# Altium schematic sheet LED.SchDoc
size A4
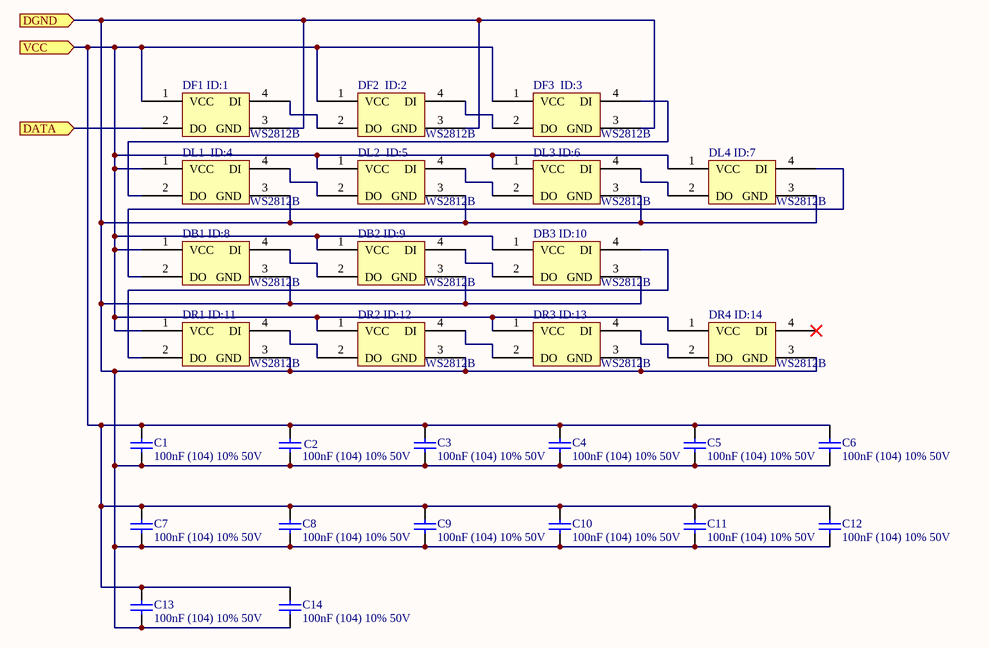
[diagram p0: LED.SchDoc]

## Parts
C1  100nF (104) 10% 50V  [0603_C]
C2  100nF (104) 10% 50V  [0603_C]
C3  100nF (104) 10% 50V  [0603_C]
C4  100nF (104) 10% 50V  [0603_C]
C5  100nF (104) 10% 50V  [0603_C]
C6  100nF (104) 10% 50V  [0603_C]
C7  100nF (104) 10% 50V  [0603_C]
C8  100nF (104) 10% 50V  [0603_C]
C9  100nF (104) 10% 50V  [0603_C]
C10  100nF (104) 10% 50V  [0603_C]
C11  100nF (104) 10% 50V  [0603_C]
C12  100nF (104) 10% 50V  [0603_C]
C13  100nF (104) 10% 50V  [0603_C]
C14  100nF (104) 10% 50V  [0603_C]
DB1_ID:8  WS2812B  [LED5050_4]
DB2_ID:9  WS2812B  [LED5050_4]
DB3_ID:10  WS2812B  [LED5050_4]
DF1_ID:1  WS2812B  [LED5050_4]
DF2_ID:2  WS2812B  [LED5050_4]
DF3_ID:3  WS2812B  [LED5050_4]
DL1_ID:4  WS2812B  [LED5050_4]
DL2_ID:5  WS2812B  [LED5050_4]
DL3_ID:6  WS2812B  [LED5050_4]
DL4_ID:7  WS2812B  [LED5050_4]
DR1_ID:11  WS2812B  [LED5050_4]
DR2_ID:12  WS2812B  [LED5050_4]
DR3_ID:13  WS2812B  [LED5050_4]
DR4_ID:14  WS2812B  [LED5050_4]

## Ports
DATA (in), DGND (in), VCC (in)

## Nets
DATA: DF1_ID:1.2(DO) ; port DATA
DGND: C1.1 C2.1 C3.1 C4.1 C5.1 C6.1 C7.1 C8.1 C9.1 C10.1 C11.1 C12.1 C13.1 C14.1 DB1_ID:8.3(GND) DB2_ID:9.3(GND) DB3_ID:10.3(GND) DF1_ID:1.3(GND) DF2_ID:2.3(GND) DF3_ID:3.3(GND) DL1_ID:4.3(GND) DL2_ID:5.3(GND) DL3_ID:6.3(GND) DL4_ID:7.3(GND) DR1_ID:11.3(GND) DR2_ID:12.3(GND) DR3_ID:13.3(GND) DR4_ID:14.3(GND) ; port DGND
VCC: C1.2 C2.2 C3.2 C4.2 C5.2 C6.2 C7.2 C8.2 C9.2 C10.2 C11.2 C12.2 C13.2 C14.2 DB1_ID:8.1(VCC) DB2_ID:9.1(VCC) DB3_ID:10.1(VCC) DF1_ID:1.1(VCC) DF2_ID:2.1(VCC) DF3_ID:3.1(VCC) DL1_ID:4.1(VCC) DL2_ID:5.1(VCC) DL3_ID:6.1(VCC) DL4_ID:7.1(VCC) DR1_ID:11.1(VCC) DR2_ID:12.1(VCC) DR3_ID:13.1(VCC) DR4_ID:14.1(VCC) ; port VCC
NetDB1_ID:8_2: DB1_ID:8.2(DO) DL4_ID:7.4(DI)
NetDB1_ID:8_4: DB1_ID:8.4(DI) DB2_ID:9.2(DO)
NetDB2_ID:9_4: DB2_ID:9.4(DI) DB3_ID:10.2(DO)
NetDB3_ID:10_4: DB3_ID:10.4(DI) DR1_ID:11.2(DO)
NetDF1_ID:1_4: DF1_ID:1.4(DI) DF2_ID:2.2(DO)
NetDF2_ID:2_4: DF2_ID:2.4(DI) DF3_ID:3.2(DO)
NetDF3_ID:3_4: DF3_ID:3.4(DI) DL1_ID:4.2(DO)
NetDL1_ID:4_4: DL1_ID:4.4(DI) DL2_ID:5.2(DO)
NetDL2_ID:5_4: DL2_ID:5.4(DI) DL3_ID:6.2(DO)
NetDL3_ID:6_4: DL3_ID:6.4(DI) DL4_ID:7.2(DO)
NetDR1_ID:11_4: DR1_ID:11.4(DI) DR2_ID:12.2(DO)
NetDR2_ID:12_4: DR2_ID:12.4(DI) DR3_ID:13.2(DO)
NetDR3_ID:13_4: DR3_ID:13.4(DI) DR4_ID:14.2(DO)

Not connected (* = marked no-connect by the designer): DR4_ID:14 4(DI)*

## Library data of the parts
C1-C14 = 0603 100nF (104) 10% 50V: 贴片电容; ComponentLink1Description: 供应商链接; ComponentLink1URL: http://www.szlcsc.com/product/details_15331.html; Package: 0603; Supplier: LC; SuppliersPartNumber: C14663
DB1_ID:8 DB2_ID:9 DB3_ID:10 DF1_ID:1 DF2_ID:2 DF3_ID:3 DL1_ID:4 DL2_ID:5 DL3_ID:6 DL4_ID:7 DR1_ID:11 DR2_ID:12 DR3_ID:13 DR4_ID:14 = WS2812B: 全彩总线LED